# EAGLE design 0229-carrier-codec-mp3-midi (EAGLE 9.6.2)
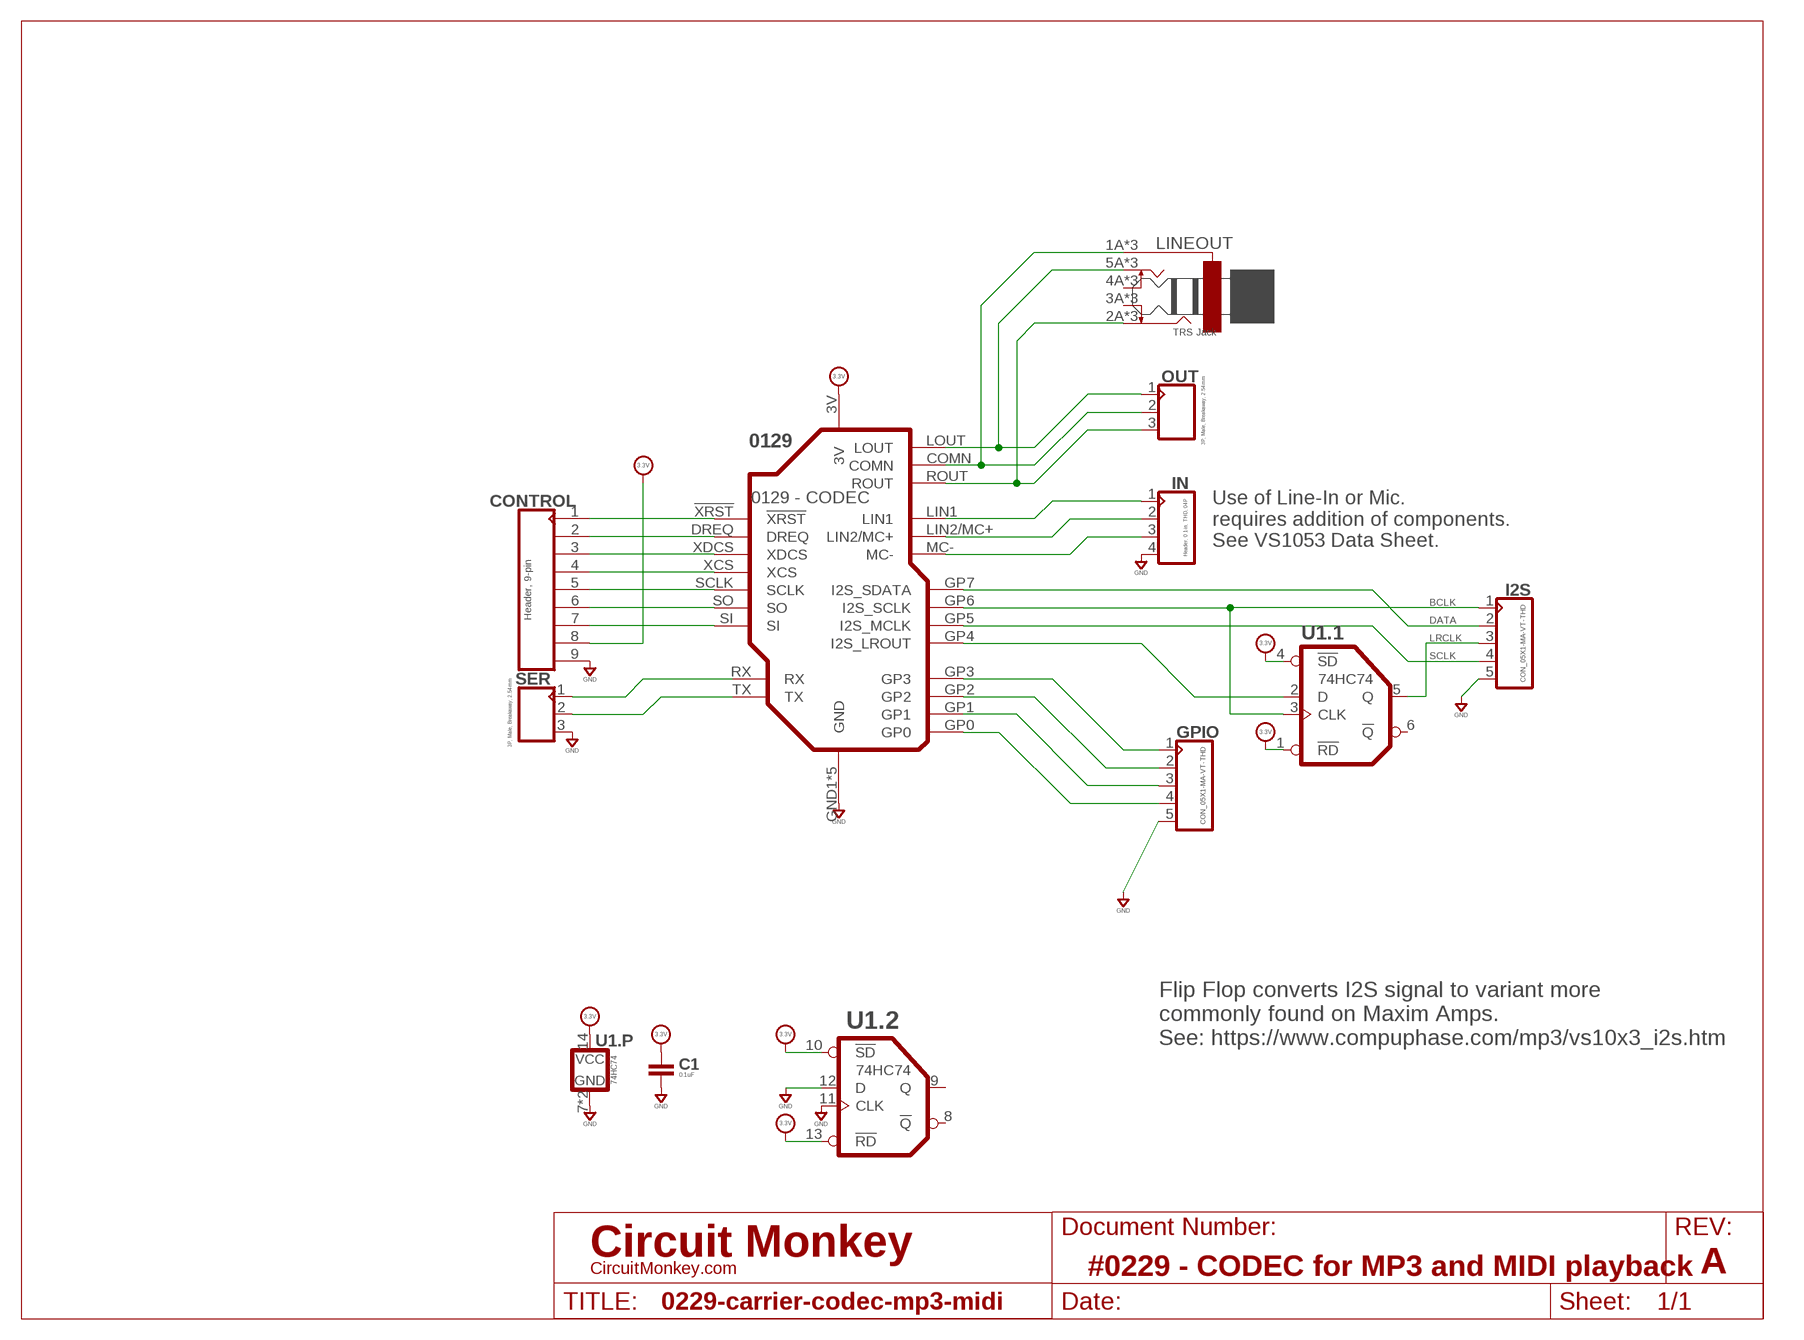
[diagram p0: schematic, sheet 1]
SHEET1 (LETTER_L-CIRCUITMONKEY): DOCUMENT_NUMBER: #0229 - CODEC for MP3 and MIDI playback; REV: A

## Parts
0129  0129 - CODEC  0129REV-A  [0129A]
C1  0.1uF  CAPACITOR0603  [0603-CAP]
CONTROL  Header, 9-pin  CON_09X1-VT-THD  [MA09X1-VT-THD]
GPIO  CON_05X1-MA-VT-THD  [MA05X1-VT-THD]
I2S  CON_05X1-MA-VT-THD  [MA05X1-VT-THD]
IN  Header, 0.1in, THD, 04P  CON_04X1-THD-VT  [MA04X1-VT-THD]
LINEOUT  TRS Jack  TRS-JACK-STEREOPJ-324  [PJ-324]
OUT  3P, Male, Breakaway, 2.54mm  CON_03X1-2.54MM-THD-VT  [MA03X1-VT-THD]
SER  3P, Male, Breakaway, 2.54mm  CON_03X1-2.54MM-THD-VT  [MA03X1-VT-THD]
U1  74HC74  74HC74BQ  [QFN14]

## Nets
+3.3V: 0129.3V C1.1 CONTROL.8 U1.1(.1:!RD) U1.4(.1:!SD) U1.10(.2:!SD) U1.13(.2:!RD) U1.14(.P:VCC) ; supply symbol labelled 3.3V
BCLK: 0129.GP6(I2S_SCLK) I2S.1 U1.3(.1:CLK)
DATA: 0129.GP7(I2S_SDATA) I2S.2
GND: 0129.GND1(GND) 0129.GND2(GND) 0129.GND3(GND) 0129.GND4(GND) 0129.GND5(GND) C1.2 CONTROL.9 GPIO.5 I2S.5 IN.4 SER.3 U1.7(.P:GND) U1.11(.2:CLK) U1.12(.2:D) U1.PAD(.P:GND)
LRCLK: I2S.3 U1.5(.1:Q)
N$1: 0129.COMN LINEOUT.1A1(S) LINEOUT.1A2(S) LINEOUT.1A(S) OUT.2
N$2: 0129.GP4(I2S_LROUT) U1.2(.1:D)
N$3: 0129.LOUT LINEOUT.5A1(T) LINEOUT.5A2(T) LINEOUT.5A(T) OUT.1
N$4: 0129.MC- IN.3
N$5: 0129.LIN2/MC+ IN.2
N$6: 0129.LIN1 IN.1
N$11: 0129.GP3 GPIO.1
N$12: 0129.GP2 GPIO.2
N$13: 0129.GP1 GPIO.3
N$14: 0129.GP0 GPIO.4
N$15: 0129.!XRST CONTROL.1
N$16: 0129.DREQ CONTROL.2
N$17: 0129.XDCS CONTROL.3
N$18: 0129.XCS CONTROL.4
N$19: 0129.SCLK CONTROL.5
N$20: 0129.SO CONTROL.6
N$21: 0129.SI CONTROL.7
N$22: 0129.RX SER.1
N$23: 0129.TX SER.2
N$24: 0129.ROUT LINEOUT.2A1(R) LINEOUT.2A2(R) LINEOUT.2A(R) OUT.3
SCLK: 0129.GP5(I2S_MCLK) I2S.4
Unconnected: LINEOUT.3A1(RN) LINEOUT.3A2(RN) LINEOUT.3A(RN) LINEOUT.4A1(TN) LINEOUT.4A2(TN) LINEOUT.4A(TN) U1.6(.1:!Q) U1.8(.2:!Q) U1.9(.2:Q)

## Notes on the sheet
- Use of Line-In or Mic.
  requires addition of components.
  See VS1053 Data Sheet.
- Flip Flop converts I2S signal to variant more
  commonly found on Maxim Amps.
  See: https://www.compuphase.com/mp3/vs10x3_i2s.htm

## Library data of the parts
0129 = circuit-monkey-chips:0129: CODEC, VS1053B, MP3 and MIDI Playback with I2S; COST01: 10.00; COST10: 9.00; COST100: 7.00; MFR: Circuit Monkey; MPN: 0129A
C1 = rlc:CAPACITOR: Capacitor; COST01: 0.12; COST10: 0.09; COST100: 0.05
CONTROL = con-headers:CON_09X1: Connector, 9-pin, 1-row; COST01: 0.15
GPIO I2S = con-headers:CON_05X1: Connector, 5P
IN = con-headers:CON_04X1: Headers, 04 pin; MFR: Molex; MPN: 022284043
LINEOUT = con-trs:TRS-JACK-STEREO: TRS Jack; COST01: 0.18; COST10: 0.18; COST100: 0.18; MFR: Tayda; MPN: A-4780
OUT SER = con-headers:CON_03X1: Header, 3-pin, single row
U1 = logic:74*74?: Flip Flop, Dual, Bi-Out; COST01: 0.55; COST10: 0.45; COST100: 0.30; MFR: Nexperia; MPN: 74HC74BQ

## Board
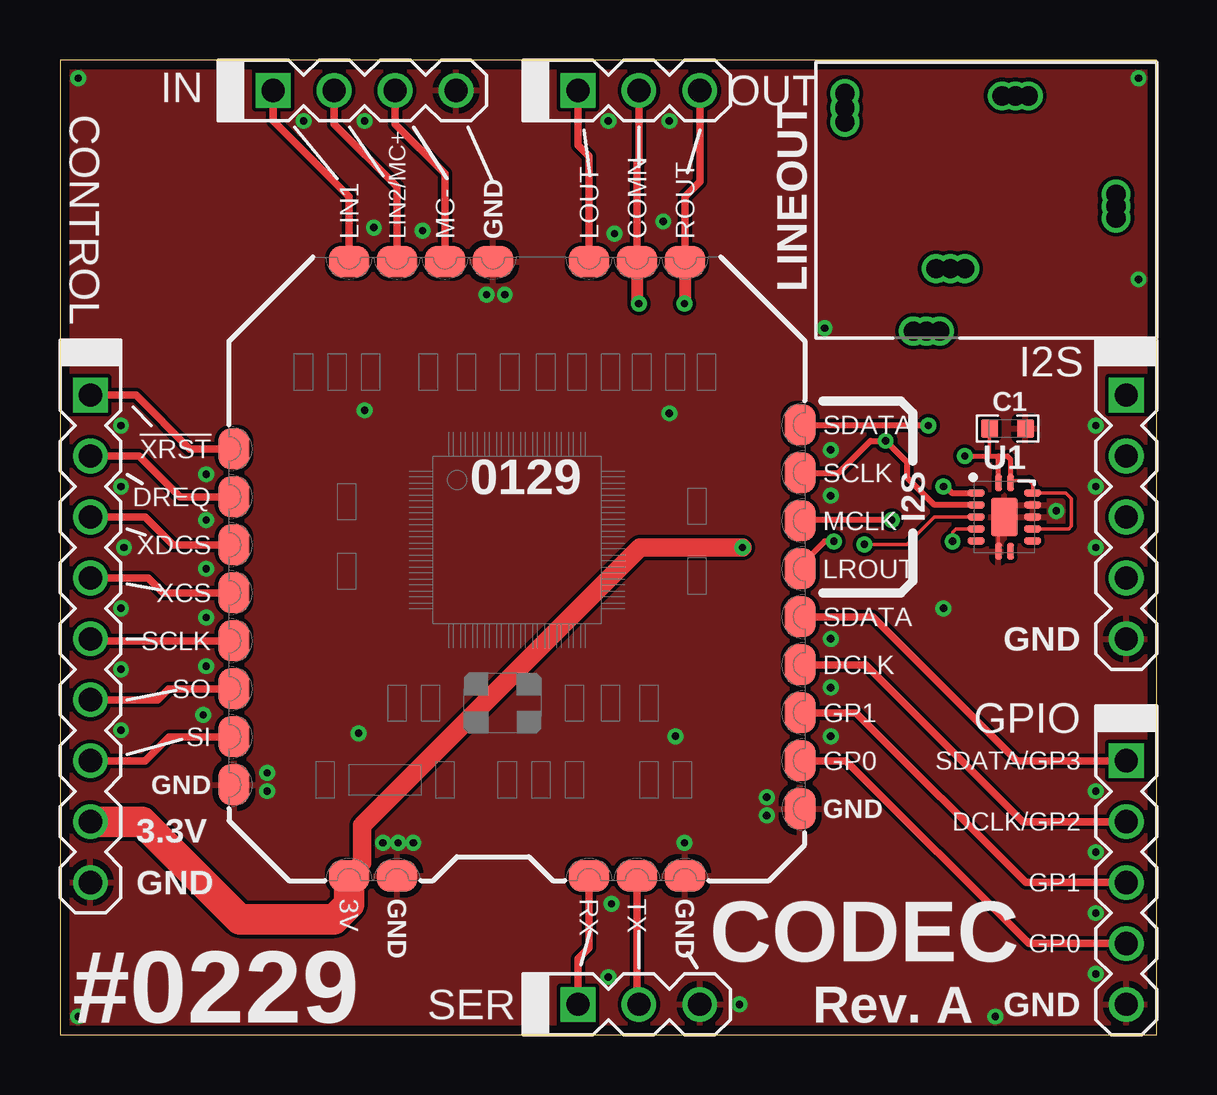
[diagram p1: board, top side]
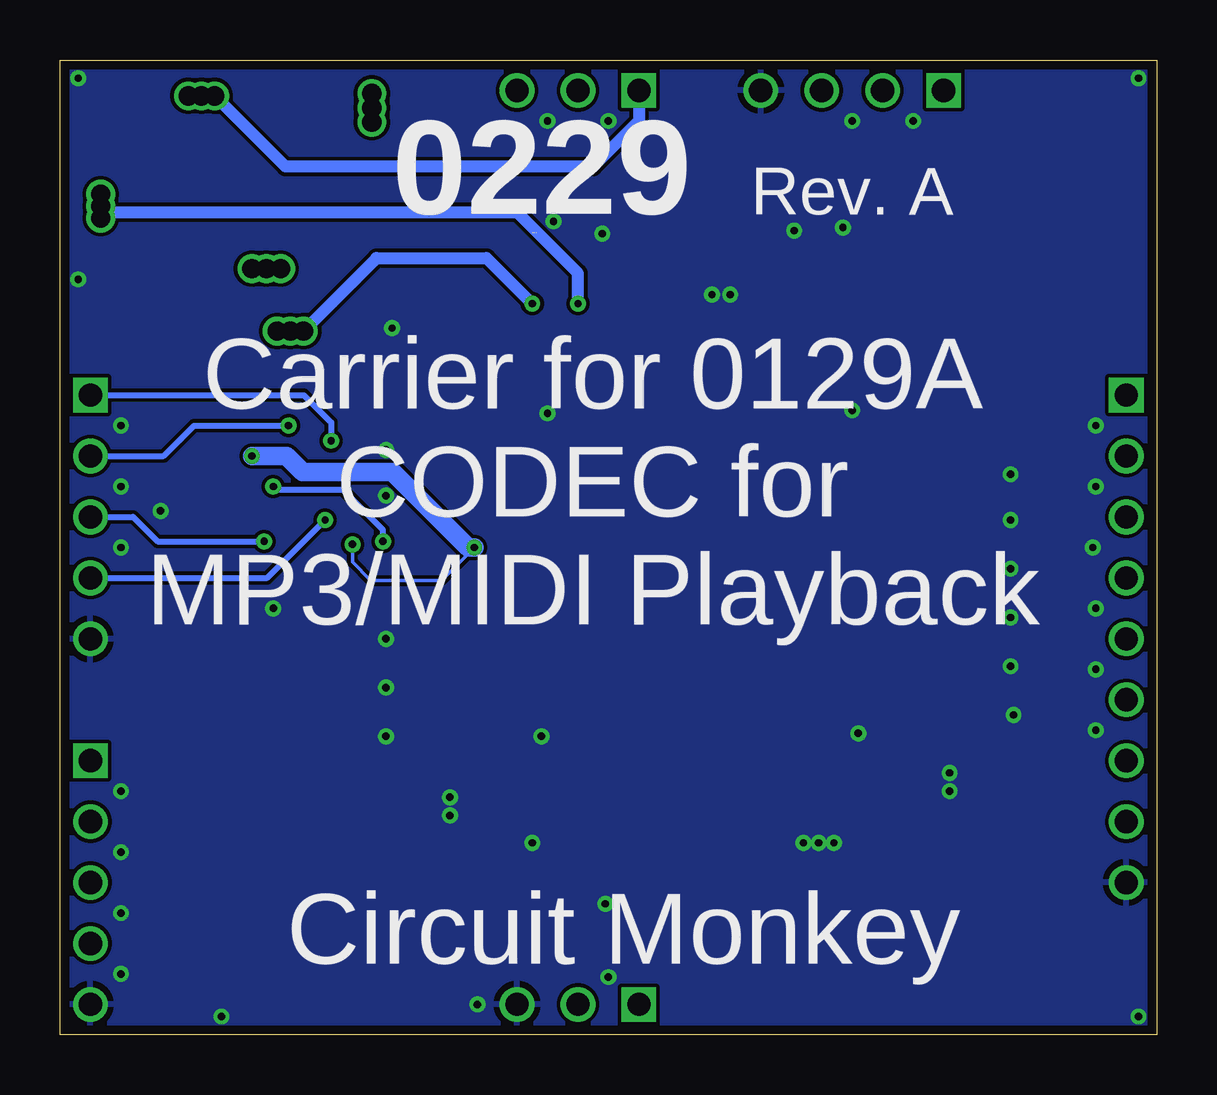
[diagram p2: board, bottom side, seen from below]

Size 45.72 x 40.64 mm. Coordinates in mm from the lower left corner, seen from the top.
Outline: 0,0 45.72,0 45.72,40.64 0,40.64 0,0
Copper layers (1*16): Top 0.0356mm / dielectric 1.5011mm / Bottom 0.0356mm
Design rules "OSH-CircuitMonkey": minimum track width 6mil, minimum drill 12mil, track to track 6mil, track to pad 6mil, pad to pad 6mil, via to via 6mil, smd to smd 6mil, copper to edge 15mil, drill to drill 6mil, minimum pad ring 7mil, minimum via ring 7mil, stop-mask expansion 3mil, vias tented up to drill 13mil, thermal gap 10mil

### Footprints (pad centres in the part's own frame; a part is rotated, then mirrored left to right if it is on the bottom)
0129A = smd 1.7 x 1.3: 3V -7,-12.8; COMN 5,12.8; GND2 -5,-12.8; GND3 7,-12.8; GND5 -1,12.8; LIN1 -7,12.8; LIN2/MC+ -5,12.8; LOUT 3,12.8; MC- -3,12.8; ROUT 7,12.8; RX 3,-12.8; TX 5,-12.8 | smd 1.3 x 1.7: !XRST -11.8,5; DREQ -11.8,3; GND1 -11.8,-9; GND4 11.8,-10; GP0 11.8,-8; GP1 11.8,-6; GP2 11.8,-4; GP3 11.8,-2; GP4 11.8,0; GP5 11.8,2; GP6 11.8,4; GP7 11.8,6; SCLK -11.8,-3; SI -11.8,-7; SO -11.8,-5; XCS -11.8,-1; XDCS -11.8,1
0603-CAP = smd 0.711 x 0.762: 1 -0.752,0; 2 0.752,0
MA09X1-VT-THD = drill 0.965 square: 1 -10.16,0 | drill 0.965: 2 -7.62,0; 3 -5.08,0; 4 -2.54,0; 5 0,0; 6 2.54,0; 7 5.08,0; 8 7.62,0; 9 10.16,0
MA05X1-VT-THD = drill 0.965 square: 1 0,0 | drill 0.965: 2 2.54,0; 3 5.08,0; 4 7.62,0; 5 10.16,0
MA04X1-VT-THD = drill 0.965 square: 1 -3.81,0 | drill 0.965: 2 -1.27,0; 3 1.27,0; 4 3.81,0
PJ-324 = drill 0.8: 1A 0,-1.7; 1A1 -0.5,-1.7; 1A2 0.5,-1.7; 2A 5.2,-9.6; 2A1 5.2,-9.05; 2A2 5.2,-10.15; 3A 2.6,-8.6; 3A1 2.6,-8; 3A2 2.6,-9.2; 4A -4.1,-13; 4A1 -4.7,-13; 4A2 -3.5,-13; 5A -4.6,-5.9; 5A1 -4.6,-5.35; 5A2 -4.6,-6.45
MA03X1-VT-THD = drill 0.965 square: 1 -2.54,0 | drill 0.965: 2 0,0; 3 2.54,0
QFN14 = smd 0.29 x 0.7: 1 -0.25,1.43; 7 -0.25,-1.43; 8 0.25,-1.43; 14 0.25,1.43 | smd 0.7 x 0.29: 2 -1.18,1; 3 -1.18,0.5; 4 -1.18,0; 5 -1.18,-0.5; 6 -1.18,-1; 9 1.18,-1; 10 1.18,-0.5; 11 1.18,0; 12 1.18,0.5; 13 1.18,1 | smd 1.1 x 1.6: PAD 0,0

### Placement (x,y rotation side)
0129  19.05,19.43 0 top
C1  39.5,25.27 0 top
CONTROL  1.27,16.51 270 top
GPIO  44.45,11.43 270 top
I2S  44.45,26.67 270 top
IN  12.7,39.37 0 top
LINEOUT  45.72,34.54 270 top
OUT  24.13,39.37 0 top
SER  24.13,1.27 0 top
U1  39.37,21.59 0 top

### Tracks (layer width: path | path; a pad name or v marks a point on that pad's centre or on a via)
+3.3V  (via drill 0.3)
  Top 0.152: U1.4 36.45,21.59 35.31,20.45 v33.53,20.45 | C1.1 38.74,24.14 38.73,24.13 | U1.10 42.05,21.09 42.16,21.21 42.16,22.35 41.93,22.59 U1.13 40.55,22.95 40.39,23.11 39.71,23.11 U1.14
  Top 0.203: v37.72,24.13 38.73,24.13 39.12,24.13 | 39.12,24.13 39.5,24.13 39.62,24 U1.14 | U1.1 39.12,24.13
  Top 0.762: 0129.3V 12.6,7.18 12.6,8.74 24.18,20.32 v28.45,20.32
  Top 1.27: CONTROL.8 3.43,8.89 7.49,4.83 11.43,4.83 12.05,5.45 0129.3V
  Bottom 0.152: v33.53,20.45 33.53,19.71 32.77,18.95 29.82,18.95 v28.45,20.32
  Bottom 0.762: v28.45,20.32 28.7,20.32 31.85,23.47 35.61,23.47 36.27,24.13 v37.72,24.13
BCLK  (via drill 0.3)
  Top 0.254: 0129.GP6 32.45,23.43 33.78,24.77 v34.42,24.77 35.31,23.88 35.31,23.24 36.46,22.09 U1.3
  Bottom 0.254: v34.42,24.77 34.42,25.53 35.56,26.67 I2S.1
DATA  (via drill 0.3)
  Top 0.254: v36.2,25.4 30.88,25.4
  Top 0.305: 30.88,25.4 0129.GP7
  Bottom 0.254: I2S.2 41.4,24.13 40.13,25.4 v36.2,25.4
GND  (via drill 0.3)
  Top 0.152: U1.7 39.12,21.34
  Top 0.254: 39.12,21.34 U1.PAD
  other vias: 0.76,0.76 0.76,39.88 44.96,39.88 38.99,0.76 43.18,2.54 28.32,1.27 26.04,8 14.1,8 13.46,8 14.73,8 8.64,10.92 8.64,10.16 2.54,12.7 2.54,15.24 2.54,17.78 2.67,20.32 2.54,22.86 2.54,25.4 10.16,38.1 12.7,38.1 22.86,38.1 25.4,38.1 43.18,25.4 43.18,22.86 43.18,20.32 43.18,10.16 43.18,7.62 43.18,5.08 32.13,24.38 32.13,22.48 36.83,17.78 32.13,16.51 32.13,14.48 32.13,12.45 29.46,9.91 29.46,9.14 18.54,30.86 17.78,30.86 15.11,33.53 13.08,33.66 6.1,23.37 6.1,21.46 6.1,19.43 6.1,17.4 6.1,15.37 5.97,13.34 25.4,25.91 12.7,26.04 12.45,12.57 25.65,12.45 31.88,29.46 44.96,31.5 22.86,2.41 22.99,5.46 23.11,33.4 25.15,33.91 41.53,21.84
  pour Top: 0,0 0,40.64 45.72,40.64 45.72,0
  pour Bottom: 45.72,0 45.72,40.64 0,40.64 0,0
LRCLK  (via drill 0.3)
  Top 0.152: v37.21,20.57 37.21,20.95 37.35,21.09 U1.5
  Bottom 0.254: I2S.3 42.67,21.59 41.66,20.57 v37.21,20.57
N$1  (via drill 0.3)
  Top 0.305: 0129.COMN 24.05,36.37 24.13,36.45 OUT.2
  Top 0.508: 0129.COMN 24.05,30.56 v24.13,30.48
  Bottom 0.508: v24.13,30.48 24.13,31.75 26.67,34.29 43.77,34.29 LINEOUT.1A | LINEOUT.1A1 LINEOUT.1A | LINEOUT.1A LINEOUT.1A2
N$2  (via drill 0.3)
  Top 0.254: v32.26,20.57 31.87,20.57 30.85,19.56 0129.GP4 | v36.83,22.86 36.9,22.86 37.17,22.59 U1.2
  Bottom 0.254: v32.26,20.57 32.26,21.05 33.94,22.73 36.7,22.73 v36.83,22.86
N$3
  Top 0.305: 0129.LOUT 22.05,36.62 21.59,37.08 OUT.1
  Bottom 0.508: OUT.1 21.59,38.1 23.5,36.2 36.32,36.2 LINEOUT.5A2 LINEOUT.5A LINEOUT.5A1
N$4
  Top 0.305: 0129.MC- 16.05,35.89 13.97,37.97 IN.3
N$5
  Top 0.305: 0129.LIN2/MC+ 14.05,35.35 11.43,37.97 IN.2
N$6
  Top 0.305: 0129.LIN1 12.05,34.94 8.89,38.1 IN.1
N$11
  Top 0.305: 0129.GP3 33.88,17.43 39.88,11.43 GPIO.1
N$12
  Top 0.305: 0129.GP2 33.59,15.43 40.13,8.89 GPIO.2
N$13
  Top 0.305: 0129.GP1 33.18,13.43 40.26,6.35 GPIO.3
N$14
  Top 0.305: 0129.GP0 32.77,11.43 40.39,3.81 GPIO.4
N$15
  Top 0.305: 0129.!XRST 5.41,24.43 3.17,26.67 CONTROL.1
N$16
  Top 0.305: 0129.DREQ 5,22.43 3.3,24.13 CONTROL.2
N$17
  Top 0.305: 0129.XDCS 4.71,20.43 3.56,21.59 CONTROL.3
N$18
  Top 0.305: 0129.XCS 4.3,18.43 3.68,19.05 CONTROL.4
N$19
  Top 0.305: 0129.SCLK 1.35,16.43 CONTROL.5
N$20
  Top 0.305: 0129.SO 4.53,14.43 4.06,13.97 CONTROL.6
N$21
  Top 0.305: 0129.SI 4.56,12.43 3.56,11.43 CONTROL.7
N$22
  Top 0.305: 0129.RX 22.05,3.63 21.59,3.17 SER.1
N$23
  Top 0.305: 0129.TX 24.05,1.35 SER.2
N$24  (via drill 0.3)
  Top 0.305: 0129.ROUT 26.05,34.94 26.67,35.56 OUT.3
  Top 0.508: 0129.ROUT 26.05,30.5 v26.04,30.48
  Bottom 0.508: LINEOUT.2A1 LINEOUT.2A LINEOUT.2A2 32.53,32.38 27.94,32.38 v26.04,30.48
SCLK  (via drill 0.3)
  Top 0.254: v34.67,21.46 30.88,21.46
  Top 0.305: 30.88,21.46 0129.GP5
  Bottom 0.254: I2S.4 37.08,19.05 v34.67,21.46

### Text on the board
tPlace: GND | SDATA/GP3 | 3.3V | DCLK/GP2 | GND | GP1 | GP0 | CODEC | #0229 | Rev. A | GND
bPlace: 0229 | Rev. A | 0229 | 0229 | Carrier for 0129A / CODEC for / MP3/MIDI Playback | Circuit Monkey